# EAGLE design sensor-water (EAGLE 9.6.2)
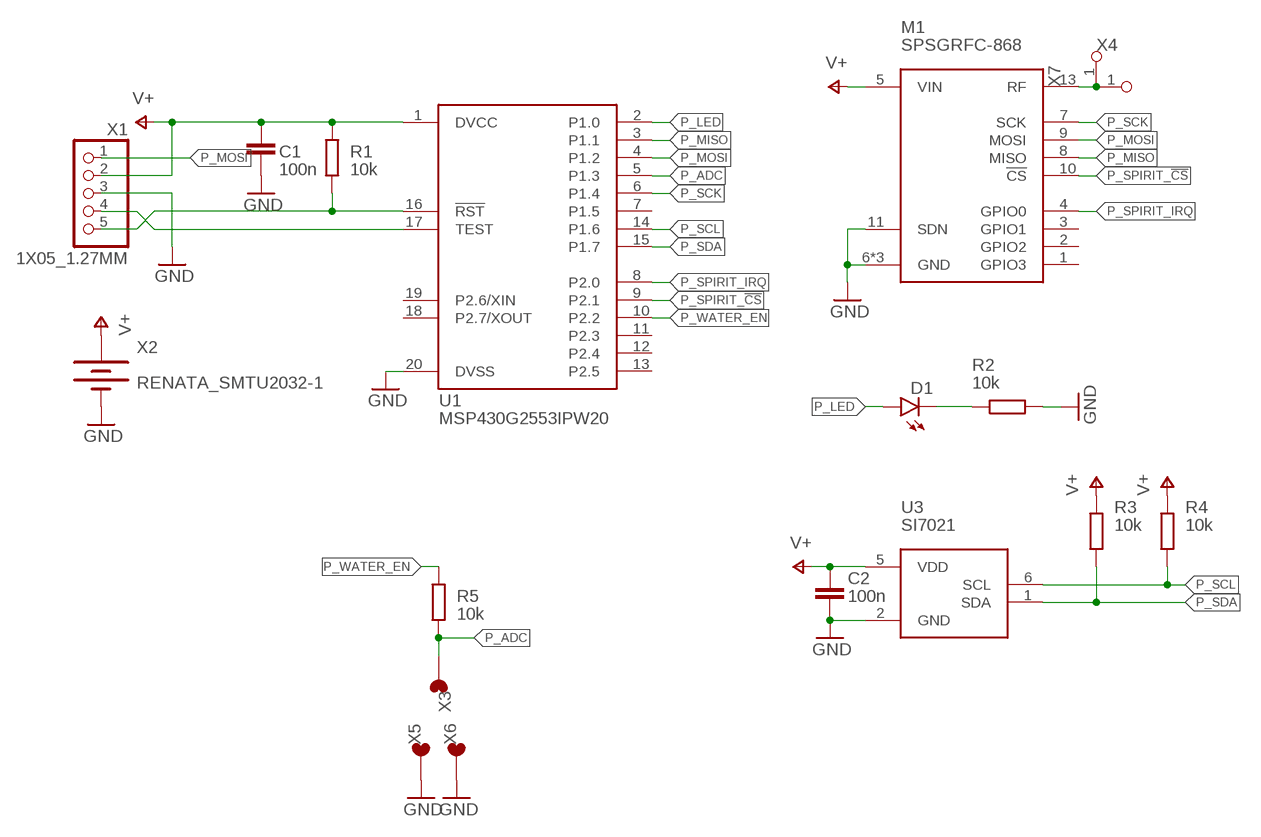
[diagram p0: schematic, sheet 1]

## Parts
C1  100n  C0805_HAND  [C0805_HAND]
C2  100n  C0805_HAND  [C0805_HAND]
D1  LEDCHIPLED_0805  [CHIPLED_0805]
M1  SPSGRFC-868  [SPSGRFC-868]
R1  10k  R0805_HAND  [R0805_HAND]
R2  10k  R0805_HAND  [R0805_HAND]
R3  10k  R0805_HAND  [R0805_HAND]
R4  10k  R0805_HAND  [R0805_HAND]
R5  10k  R0805_HAND  [R0805_HAND]
U1  MSP430G2553IPW20  [PW20]
U3  SI7021  [DFN6-3X3]
X1  1X05_1.27MM  [1X05_1.27MM]
X2  RENATA_SMTU2032-1  [RENATA_SMTU2032-1]
X3  WASSERW_FOOTS  [WASSERW_FOOTS]
X4  PINHD_1_RND  [1X01_NOSILK]
X5  WASSERW_FOOTS  [WASSERW_FOOTS]
X6  WASSERW_FOOTS  [WASSERW_FOOTS]
X7  PINHD_1_RND  [1X01_NOSILK]

## Nets
GND: C1.2 C2.2 M1.6(GND) M1.11(SDN) M1.12(GND) M1.14(GND) R2.2 U1.20(DVSS) U3.2(GND) X1.3 X2.2(-) X5.1 X6.1
N$1: D1.C R2.1
N$2: R1.1 U1.16(!RST!) X1.5
N$3: U1.17(TEST) X1.4
N$4: M1.13(RF) X4.1 X7.1
P_ADC: R5.1 U1.5(P1.3) X3.1
P_LED: D1.A U1.2(P1.0)
P_MISO: M1.8(MISO) U1.3(P1.1)
P_MOSI: M1.9(MOSI) U1.4(P1.2) X1.1
P_SCK: M1.7(SCK) U1.6(P1.4)
P_SCL: R4.1 U1.14(P1.6) U3.6(SCL)
P_SDA: R3.1 U1.15(P1.7) U3.1(SDA)
P_SPIRIT_!CS: M1.10(!CS) U1.9(P2.1)
P_SPIRIT_IRQ: M1.4(GPIO0) U1.8(P2.0)
P_WATER_EN: R5.2 U1.10(P2.2)
V+: C1.1 C2.1 M1.5(VIN) R1.2 R3.2 R4.2 U1.1(DVCC) U3.5(VDD) X1.2 X2.1(+)
Unconnected: M1.1(GPIO3) M1.2(GPIO2) M1.3(GPIO1) U1.7(P1.5) U1.11(P2.3) U1.12(P2.4) U1.13(P2.5) U1.18(P2.7/XOUT) U1.19(P2.6/XIN)

## Library data of the parts
C1 C2 = rfr-lib-passive:C: Standard-SMD-Kondensatoren
D1 = led:LED: LED OSRAM: - CHIPLED LG R971, LG N971, LY N971, LG Q971, LY Q971, LO R971, LY R971 LH N974, LH R974 LS Q976, LO Q976, LY Q976 LO Q996 - Hyper CHIPLED LW Q18S LB Q993, LB Q99A, LB R99A - SideLED LS A670, LO A670, LY A670, LG A670, LP A670 LB A673, LV A673, LT A673, LW A673 LH A674 LY A675 LS A676, LA A676, LO A676, LY A676, LW A676 LS A679, LY A679, LG A679 - Hyper Micro SIDELED® LS Y876, LA Y876, LO Y876, LY Y876 LT Y87S - SmartLED LW L88C, LW L88S LB L89C, LB L89S, LG L890 LS L89K, LO L89K, LY L89K LS L896, LA L896, LO L896, LY L896 - TOPLED LS T670, LO T670, LY T670, LG T670, LP T670 LSG T670, LSP T670, LSY T670, LOP T670, LYG T670 LG T671, LOG T671, LSG T671 LB T673, LV T673, LT T673, LW T673 LH T674 LS T676, LA T676, LO T676, LY T676, LB T676, LH T676, LSB T676, LW T676 LB T67C, LV T67C, LT T67C, LS T67K, LO T67K, LY T67K, LW E67C LS E67B, LA E67B, LO E67B, LY E67B, LB E67C, LV E67C, LT E67C LW T67C LS T679, LY T679, LG T679 LS T770, LO T770, LY T770, LG T770, LP T770 LB T773, LV T773, LT T773, LW T773 LH T774 LS E675, LA E675, LY E675, LS T675 LS T776, LA T776, LO T776, LY T776, LB T776 LHGB T686 LT T68C, LB T68C - Hyper Mini TOPLED® LB M676 - Mini TOPLED Santana® LG M470 LS M47K, LO M47K, LY M47K Source: http://www.osram.convergy.de LUXEON: - LUMILED® LXK2-PW12-R00, LXK2-PW12-S00, LXK2-PW14-U00, LXK2-PW14-V00 LXK2-PM12-R00, LXK2-PM12-S00, LXK2-PM14-U00 LXK2-PE12-Q00, LXK2-PE12-R00, LXK2-PE12-S00, LXK2-PE14-T00, LXK2-PE14-U00 LXK2-PB12-K00, LXK2-PB12-L00, LXK2-PB12-M00, LXK2-PB14-N00, LXK2-PB14-P00, LXK2-PB14-Q00 LXK2-PR12-L00, LXK2-PR12-M00, LXK2-PR14-Q00, LXK2-PR14-R00 LXK2-PD12-Q00, LXK2-PD12-R00, LXK2-PD12-S00 LXK2-PH12-R00, LXK2-PH12-S00 LXK2-PL12-P00, LXK2-PL12-Q00, LXK2-PL12-R00 Source: www.luxeon.com KINGBRIGHT: KA-3528ASYC Source: www.kingbright.com
M1 = rfr-lib-radio:SPSGRFC-868
R1-R5 = rfr-lib-passive:R: Standard-SMD-Widerstände
U1 = rfr-lib-digital:MSP430G2553: MSP430G2XX1 TSSOP (PW) 20 Pin Package
U3 = rfr-lib-sensors:SI7021
X1 = msp430-nrf-wsn-lib:1X05_1.27MM
X2 = msp430-nrf-wsn-lib:RENATA_SMTU2032-1
X3 X5 X6 = rfr-lib-misc:WASSERW_FOOTS
X4 X7 = rfr-lib-connector:PINHD_1_RND

## Board
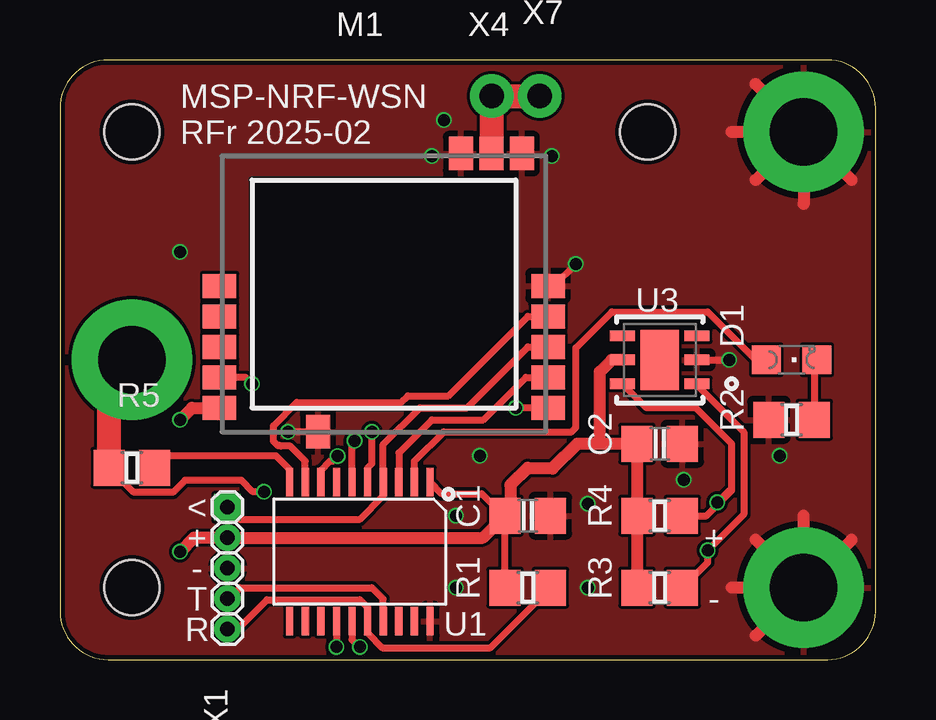
[diagram p1: board, top side]
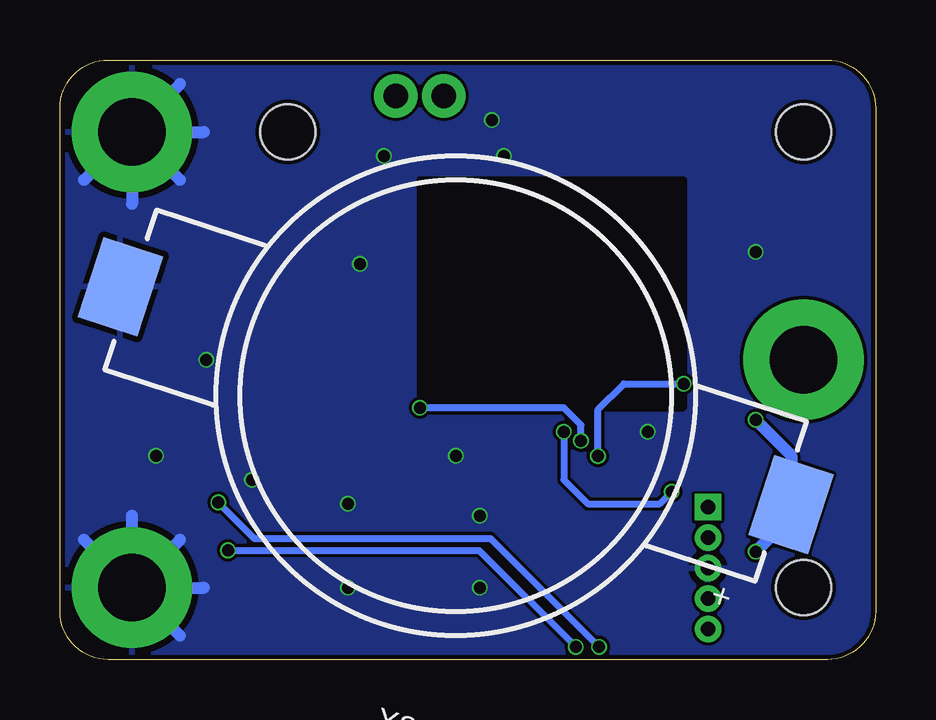
[diagram p2: board, bottom side, seen from below]

Size 34 x 25 mm. Coordinates in mm from the lower left corner, seen from the top.
Outline: 32,25 2,25 arc90 0,23 0,2 arc90 2,0 32,0 arc90 34,2 34,23 arc90 32,25
Copper layers (1*16): Top 0.035mm / dielectric 1.6mm / Bottom 0.035mm
Design rules "jlcpcb-2layers *": minimum track width 5mil, minimum drill 0.3mm, track to track 5mil, track to pad 5mil, pad to pad 5mil, via to via 5mil, smd to smd 5mil, copper to edge 0.2mm, drill to drill 6mil, minimum pad ring 10mil, minimum via ring 3mil, stop-mask expansion 4mil, vias tented up to drill 0.7mm, thermal gap 10mil
Holes 2.3 mm at 3,22 3,3 24.5,22

### Footprints (pad centres in the part's own frame; a part is rotated, then mirrored left to right if it is on the bottom)
C0805_HAND = smd 1.3 x 1.5: 1 -0.95,0; 2 0.95,0
CHIPLED_0805 = smd 1.2 x 1.2: A 0,-1.05; C 0,1.05
SPSGRFC-868 = smd 1.4 x 1: 1 -6.85,6.08; 2 -6.85,4.81; 3 -6.85,3.54; 4 -6.85,2.27; 5 -6.85,1; 7 6.85,1; 8 6.85,2.27; 9 6.85,3.54; 10 6.85,4.81; 11 6.85,6.08 | smd 1 x 1.4: 6 -2.75,0; 12 5.75,11.6; 13 4.48,11.6; 14 3.21,11.6
R0805_HAND = smd 1.3 x 1.5: 1 -0.95,0; 2 0.95,0
PW20 = smd 0.3 x 1.2: 1 -2.925,-2.9; 2 -2.275,-2.9; 3 -1.625,-2.9; 4 -0.975,-2.9; 5 -0.325,-2.9; 6 0.325,-2.9; 7 0.975,-2.9; 8 1.625,-2.9; 9 2.275,-2.9; 10 2.925,-2.9; 11 2.925,2.9; 12 2.275,2.9; 13 1.625,2.9; 14 0.975,2.9; 15 0.325,2.9; 16 -0.325,2.9; 17 -0.975,2.9; 18 -1.625,2.9; 19 -2.275,2.9; 20 -2.925,2.9
DFN6-3X3 = smd 1.05 x 0.45: 1 -1.55,1; 2 -1.55,0; 3 -1.55,-1; 4 1.55,-1; 5 1.55,0; 6 1.55,1 | smd 1.6 x 2.5: EXP 0,0
1X05_1.27MM = drill 0.6 square: 1 -2.54,0 | drill 0.6: 2 -1.27,0; 3 0,0; 4 1.27,0; 5 2.54,0
RENATA_SMTU2032-1 = smd 2.6 x 3.5: 1 -14.7,0; 2 14.7,0
WASSERW_FOOTS = drill 2.8 pad 5: 1 0,0
1X01_NOSILK = drill 1.016 pad 1.778: 1 0,0

### Placement (x,y rotation side)
C1  19.5,6 0 top
C2  25,9 0 top
D1  30.5,12.5 270 top
M1  13.5,9.5 0 top
R1  19.5,3 180 top
R2  30.5,10 180 top
R3  25,3 180 top
R4  25,6 180 top
R5  3,8 0 top
U1  12.5,4.5 180 top
U3  25,12.5 180 top
X1  6.99,3.81 270 top
X2  17.5,11 162 bottom
X3  3,12.5 0 top
X4  18,23.5 0 top
X5  31,3 0 top
X6  31,22 0 top
X7  20,23.5 0 top

### Tracks (layer width: path | path; a pad name or v marks a point on that pad's centre or on a via)
GND  (via drill 0.5)
  Top 0.3: U3.2 v27.9,12.5 | v21.5,16.5 20.58,15.58 M1.11 | M1.6 v9.5,9.5
  Top 0.5: X6.1 29,24 | X6.1 28,22 | X6.1 29,20 | X6.1 31,19 | X6.1 33,20 | X5.1 33,5 | X5.1 31,6 | X5.1 29,5 | X5.1 28,3 | X5.1 29,1
  Bottom 0.5: X5.1 31,6 | X5.1 33,5 | X5.1 29,5 | X5.1 28,3 | X5.1 29,1 | X6.1 31,19 | X6.1 33,20 | X6.1 29,20 | X6.1 28,22 | X6.1 29,24
  other vias: 16.5,3 22,6.5 22,3 26,7.5 30,8.5 20.5,21 15.5,21 16,22.5 16.5,6 17.5,8.5 5,17
  pour Top: -0.5,25.27 34.5,25.27 34.5,-0.5 -0.5,-0.5
  pour Bottom: 34.5,25.27 -0.5,25.27 -0.5,-0.5 34.5,-0.5
  cutout Bottom (rank 2): 8,20 19,20 19,10.5 8,10.5
  cutout Top (rank 2): 19,20 8,20 8,10.5 19,10.5
N$1
  Top 0.3: D1.C 31.45,12.4 R2.1
N$2
  Top 0.3: X1.5 7.41,1.27 8.63,2.5 12.5,2.5 12.82,2.17 U1.16 12.82,1.11 13.43,0.5 17.95,0.5 R1.1
N$3
  Top 0.3: X1.4 7.04,2.54 7.5,3 13,3 13.47,2.52 U1.17
N$4
  Top 1: M1.13 18,21.12 X4.1 X7.1
P_ADC  (via drill 0.5)
  Top 0.3: U1.5 12.82,8 13,8.18 v13,9.5 | v8.5,7 8.04,7 7.57,7.47 5.21,7.47 4.71,6.97 3.08,6.97 R5.1
  Top 1: R5.1 2.05,11.55 X3.1
  Bottom 0.3: v13,9.5 13,7.5 12,6.5 9,6.5 v8.5,7
P_LED
  Top 0.3: U1.2 14.78,8.28 16,9.5 21.33,9.5 21.5,9.67 21.5,11.5 21.5,13 23,14.5 27,14.5 28,13.5 29,12.5 D1.A
P_MISO
  Top 0.3: U1.3 14.12,8.62 15.5,10 17.65,10 19.42,11.77 M1.8
P_MOSI
  Top 0.3: X1.1 7.49,5.85 12.5,5.85 13.47,6.83 U1.4 13.47,8.97 15,10.5 16.96,10.5 19.5,13.04 M1.9
P_SCK  (via drill 0.5)
  Top 0.3: U1.6 12.18,9.01 v12.28,9.12 | M1.7 v19,10.5
  Bottom 0.3: v12.28,9.12 12.28,9.78 13,10.5 v19,10.5
P_SCL  (via drill 0.5)
  Top 0.3: U1.14 v11.53,0.53 | v11.53,0.53 11.5,0.5 v11.53,0.53 | 28,7.05 26.95,6 R4.1 | U3.6 24.45,10.5 26.5,10.5 28,9 28,7.05 | 28,7.05 27.9,7.05 v27.4,6.55
  Bottom 0.3: v11.53,0.53 16.05,5.05 25.9,5.05 v27.4,6.55
P_SDA  (via drill 0.5)
  Top 0.3: U1.15 12.18,0.82 12.47,0.53 v12.5,0.53 | R3.1 27,4.05 v27,4.55 28.5,6.05 28.5,9.5 26.55,11.45 U3.1
  Bottom 0.3: v27,4.55 16.52,4.55 v12.5,0.53
P_SPIRIT_!CS
  Top 0.3: M1.10 19.5,14.31 16.19,11 14.5,11 14.22,10.72 9.87,10.72 8.9,9.75 8.9,9.1 9.07,8.93 9.18,8.93 9.21,8.9 9.6,8.9 10.22,8.28 U1.9
P_SPIRIT_IRQ  (via drill 0.5)
  Top 0.3: v11.57,8.48 11.37,8.28 11.26,8.28 10.88,7.89 U1.8 | v8,11.5 7.73,11.77 M1.4
  Bottom 0.3: v11.57,8.48 11.57,10.43 10.5,11.5 v8,11.5
P_WATER_EN
  Top 0.3: U1.10 9.57,7.92 9,8.5 4.45,8.5 R5.2
V+  (via drill 0.5)
  Top 0.3: R1.2 C1.1 18.5,6 17.59,6.91 15.91,6.91 U1.1
  Top 0.5: C2.1 R4.2 R3.2 | C2.1 22.5,9 22.5,12 23,12.5 U3.5 | v5,10 5.5,10.5 M1.5 | C2.1 21.57,9 20.54,7.96 19.54,7.96 19.5,8 18.77,7.28 18.77,6.22 C1.1 17.63,5.08 X1.2 5.58,5.08 v5,4.5
  Bottom 0.5: v5,4.5 3.52,5.98 X2.1 3.52,8.52 v5,10

### Text on the board
tPlace: MSP-NRF-WSN | RFr 2025-02 | < | + | + | - | T | - | R